# EAGLE board Sensor_POD (EAGLE 9.0.1)
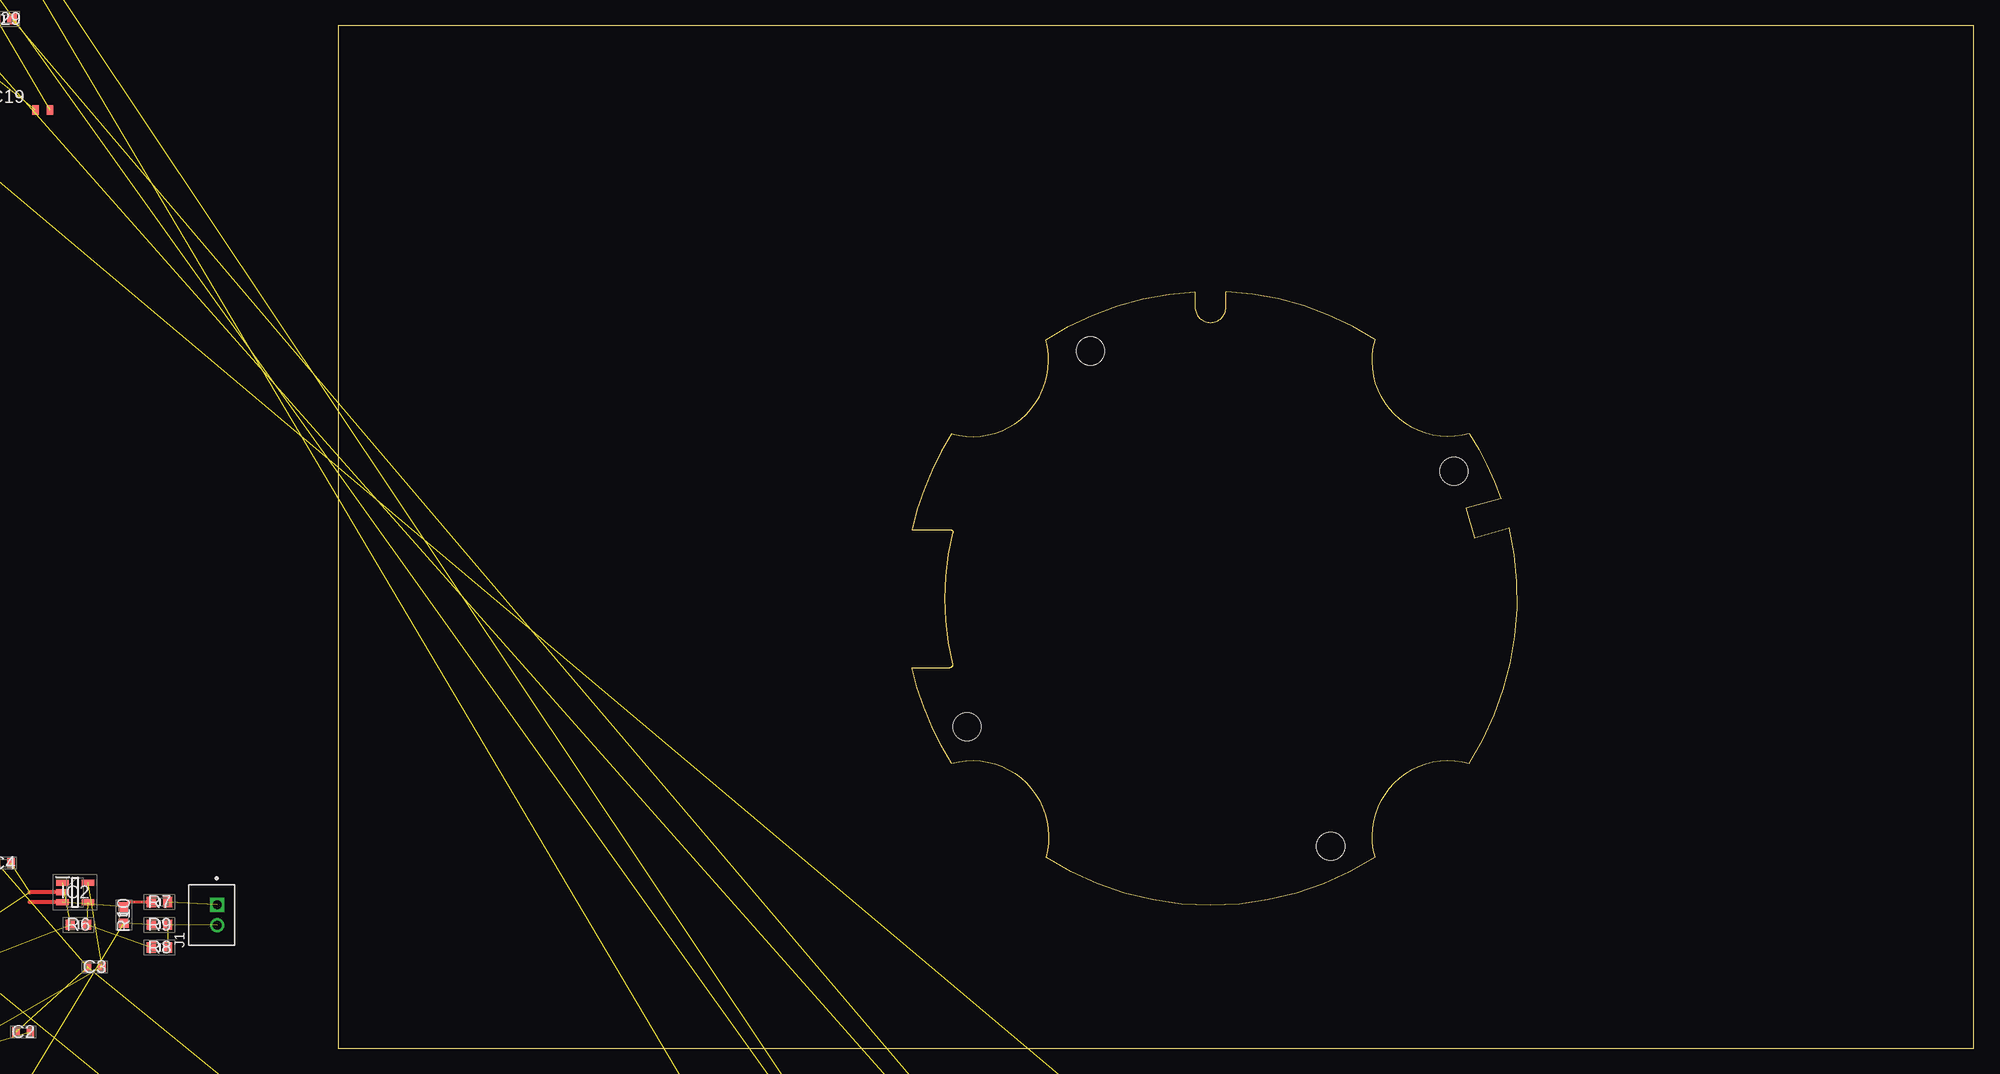
[diagram p9: board, top side]

Size 160 x 100 mm. Coordinates in mm from the lower left corner, seen from the top.
Outline: 83.82,73.9 83.82,72.47 arc180 86.84,72.47 86.84,73.9
Outline: 86.84,73.98 arc-30 101.44,69.29 arc122 110.65,60.09 arc-14 113.74,53.74 110.33,52.78 111.12,49.93 114.54,50.88 arc-46 110.65,27.86 arc122 101.44,18.65 arc-65 69.22,18.65 arc121 60.01,27.86 arc-19 56.12,37.23 59.77,37.23 arc90 60.17,37.54 arc-28 60.17,50.4 arc90 59.85,50.72 56.12,50.72 arc-19 60.01,60.09 arc121 69.22,69.29 arc-30 83.82,73.98
Outline: 0,0 160,0 160,100 0,100 0,0
Copper layers (1*16): Top 0.035mm / dielectric 1.5mm / Bottom 0.035mm
Design rules "default": minimum track width 6mil, minimum drill 0.35mm, track to track 6mil, track to pad 6mil, pad to pad 6mil, via to via 6mil, smd to smd 6mil, copper to edge 40mil, drill to drill 6mil, minimum pad ring 10mil, minimum via ring 8mil, stop-mask expansion 4mil, vias tented up to drill 0mil, thermal gap 10mil
Holes 2.75 mm at 73.58,68.18 97.08,19.76 109.14,56.44 61.52,31.43

## Footprints (pad centres in the part's own frame; a part is rotated, then mirrored left to right if it is on the bottom)
CAPC1608X90N = smd 0.75 x 0.94: 1 -0.7,0; 2 0.7,0
CAPC1608X100N = smd 0.87 x 1.02: 1 -0.68,0; 2 0.68,0
CAPC1608X85N = smd 0.66 x 0.94: 1 -0.711,0; 2 0.711,0
CAPC1608X87N = smd 0.78 x 0.98: 1 -0.7,0; 2 0.7,0
CAPC1608X90N@1 = smd 0.75 x 0.94: 1 -0.7,0; 2 0.7,0
CAPC1608X97N = smd 0.78 x 0.98: 1 -0.7,0; 2 0.7,0
FDLL914B = smd 1.25 x 2: 1 -1.875,0; 2 1.875,0
BLM18KG102SH1J = smd 0.65 x 0.7: 1 -0.675,0; 2 0.675,0
BEADC1608X75N = smd 0.9 x 1: 1 -0.8,0; 2 0.8,0
SOT95P280X145-5N = smd 1.25 x 0.6: 1 -1.25,0.95; 2 -1.25,0; 3 -1.25,-0.95; 4 1.25,-0.95; 5 1.25,0.95
SOP65P490X110-9N = smd 1.425 x 0.45: 1 -2.212,0.975; 2 -2.212,0.325; 3 -2.212,-0.325; 4 -2.212,-0.975; 5 2.212,-0.975; 6 2.212,-0.325; 7 2.212,0.325; 8 2.212,0.975 | smd 1.88 x 2.515: 9 0,0
SOP50P490X110-10N = smd 1.4 x 0.3: 1 -2.2,1; 2 -2.2,0.5; 3 -2.2,0; 4 -2.2,-0.5; 5 -2.2,-1; 6 2.2,-1; 7 2.2,-0.5; 8 2.2,0; 9 2.2,0.5; 10 2.2,1
SOP65P640X120-24N = smd 1.475 x 0.45: 1 -2.938,3.575; 2 -2.938,2.925; 3 -2.938,2.275; 4 -2.938,1.625; 5 -2.938,0.975; 6 -2.938,0.325; 7 -2.938,-0.325; 8 -2.938,-0.975; 9 -2.938,-1.625; 10 -2.938,-2.275; 11 -2.938,-2.925; 12 -2.938,-3.575; 13 2.938,-3.575; 14 2.938,-2.925; 15 2.938,-2.275; 16 2.938,-1.625; 17 2.938,-0.975; 18 2.938,-0.325; 19 2.938,0.325; 20 2.938,0.975; 21 2.938,1.625; 22 2.938,2.275; 23 2.938,2.925; 24 2.938,3.575
SOT95P280X110-5N = smd 1.25 x 0.6: 1 -1.25,0.95; 2 -1.25,0; 3 -1.25,-0.95; 4 1.25,-0.95; 5 1.25,0.95
SOP65P490X110-8N = smd 1.425 x 0.45: 1 -2.212,0.975; 2 -2.212,0.325; 3 -2.212,-0.325; 4 -2.212,-0.975; 5 2.212,-0.975; 6 2.212,-0.325; 7 2.212,0.325; 8 2.212,0.975
SOT65P210X110-5N = smd 1.2 x 0.4: 1 -0.95,0.65; 2 -0.95,0; 3 -0.95,-0.65; 4 0.95,-0.65; 5 0.95,0.65
SO08 = smd 0.6 x 2.2: 1 -1.905,-2.6; 2 -0.635,-2.6; 3 0.635,-2.6; 4 1.905,-2.6; 5 1.905,2.6; 6 0.635,2.6; 7 -0.635,2.6; 8 -1.905,2.6
SOT95P280X110-6N = smd 1.25 x 0.6: 1 -1.25,0.95; 2 -1.25,0; 3 -1.25,-0.95; 4 1.25,-0.95; 5 1.25,0; 6 1.25,0.95
SOIC127P600X175-8N = smd 1.528 x 0.65: 1 -2.711,1.905; 2 -2.711,0.635; 3 -2.711,-0.635; 4 -2.711,-1.905; 5 2.711,-1.905; 6 2.711,-0.635; 7 2.711,0.635; 8 2.711,1.905
SOT95P280X145-6N = smd 1.2 x 0.6: 1 -1.25,0.95; 2 -1.25,0; 3 -1.25,-0.95; 4 1.25,-0.95; 5 1.25,0; 6 1.25,0.95
QFP50P900X900X160-48N = smd 1.475 x 0.3: 1 -4.238,2.75; 2 -4.238,2.25; 3 -4.238,1.75; 4 -4.238,1.25; 5 -4.238,0.75; 6 -4.238,0.25; 7 -4.238,-0.25; 8 -4.238,-0.75; 9 -4.238,-1.25; 10 -4.238,-1.75; 11 -4.238,-2.25; 12 -4.238,-2.75; 25 4.238,-2.75; 26 4.238,-2.25; 27 4.238,-1.75; 28 4.238,-1.25; 29 4.238,-0.75; 30 4.238,-0.25; 31 4.238,0.25; 32 4.238,0.75; 33 4.238,1.25; 34 4.238,1.75; 35 4.238,2.25; 36 4.238,2.75 | smd 0.3 x 1.475: 13 -2.75,-4.238; 14 -2.25,-4.238; 15 -1.75,-4.238; 16 -1.25,-4.238; 17 -0.75,-4.238; 18 -0.25,-4.238; 19 0.25,-4.238; 20 0.75,-4.238; 21 1.25,-4.238; 22 1.75,-4.238; 23 2.25,-4.238; 24 2.75,-4.238; 37 2.75,4.238; 38 2.25,4.238; 39 1.75,4.238; 40 1.25,4.238; 41 0.75,4.238; 42 0.25,4.238; 43 -0.25,4.238; 44 -0.75,4.238; 45 -1.25,4.238; 46 -1.75,4.238; 47 -2.25,4.238; 48 -2.75,4.238
JST_B2B-PH-K-S(LF)(SN) = drill 0.86 square: 1 1,-0.55 | drill 0.86: 2 -1,-0.55
SHDR4W50P0X200_1X4_990X450X600 = drill 0.9 pad 1.35 square: 1 0,0 | drill 0.9 pad 1.35: 2 -2,0; 3 -4,0; 4 -6,0
SHDR5W50P0X200_1X5_1190X450X60 = drill 0.9 pad 1.35 square: 1 0,0 | drill 0.9 pad 1.35: 2 -2,0; 3 -4,0; 4 -6,0; 5 -8,0
RESC1608X55N@2 = smd 0.9 x 1: 1 -0.8,0; 2 0.8,0
RESC1608X50N = smd 0.95 x 1: 1 -0.8,0; 2 0.8,0
RESC1608X55N = smd 0.9 x 1: 1 -0.8,0; 2 0.8,0
R0603 = smd 1 x 1.1: 1 -0.85,0; 2 0.85,0
RESC1608X55N@1 = smd 0.9 x 1: 1 -0.8,0; 2 0.8,0
SOT23 = smd 1 x 1.4: 1 -0.95,-1.1; 2 0.95,-1.1; 3 0,1.1
B1,27 = smd 1.27 x 1.27: TP 0,0
FA20H160000MF12ZAC3 = smd 1.2 x 1.1: 1 -0.85,-0.7; 2 0.85,-0.7; 3 0.85,0.7; 4 -0.85,0.7

## Placement (x,y rotation side)
C1  0603YC105JAT2A  [CAPC1608X90N]  -131.76,-64.45 0 top  (outside the outline)
C2  0603YC105JAT2A  [CAPC1608X90N]  -30.8,1.59 0 top  (outside the outline)
C3  100nF / 16V  [CAPC1608X90N]  -23.81,7.94 0 top  (outside the outline)
C4  100nF / 16V  [CAPC1608X90N]  -32.7,18.1 0 top  (outside the outline)
C5  100nF / 16V  [CAPC1608X90N]  -147,-68.26 0 top  (outside the outline)
C6  100nF / 16V  [CAPC1608X90N]  -143.19,-68.26 0 top  (outside the outline)
C7  100nf / 16V  [CAPC1608X90N]  -317.18,-489.9 0 top  (outside the outline)
C8  100nF / 16V  [CAPC1608X90N]  -150.81,-75.88 0 top  (outside the outline)
C9  100nF / 16V  [CAPC1608X90N]  -150.81,-79.69 0 top  (outside the outline)
C10  3.3uF/ 35V  [CAPC1608X90N]  -154.62,-87.31 0 top  (outside the outline)
C11  10uF / 16V  [CAPC1608X100N]  -214.31,-201.61 0 top  (outside the outline)
C12  10uF / 16V  [CAPC1608X100N]  -214.31,-205.42 0 top  (outside the outline)
C13  0603YC104JAT2A  [CAPC1608X90N]  113.03,-41.91 0 top  (outside the outline)
C14  0603YC104JAT2A  [CAPC1608X90N]  109.22,-45.72 0 top  (outside the outline)
C15  0603YC104JAT2A  [CAPC1608X90N]  99.06,-64.77 0 top  (outside the outline)
C16  0603YC104JAT2A  [CAPC1608X90N]  95.25,-68.58 0 top  (outside the outline)
C17  0603YC104JAT2A  [CAPC1608X90N]  87.63,-76.2 0 top  (outside the outline)
C18  0603YC104JAT2A  [CAPC1608X90N]  83.82,-80.01 0 top  (outside the outline)
C19  C0603C102J5GACTU  [CAPC1608X85N]  -28.89,91.76 0 top  (outside the outline)
C20  C0603C103J5RACTU  [CAPC1608X87N]  -40.32,84.14 0 top  (outside the outline)
C21  100nF / 16v  [CAPC1608X90N]  -59.37,53.66 0 top  (outside the outline)
C22  100nF / 16V  [CAPC1608X90N]  -63.18,49.85 0 top  (outside the outline)
C23  0603YC104JAT2A  [CAPC1608X90N]  -63.18,38.42 0 top  (outside the outline)
C24  0603YC104JAT2A  [CAPC1608X90N]  -63.18,34.61 0 top  (outside the outline)
C25  100nf / 16V  [CAPC1608X90N]  -65.72,26.99 0 top  (outside the outline)
C26  100nF / 16V  [CAPC1608X90N]  -65.72,23.18 0 top  (outside the outline)
C27  0603YC104JAT2A  [CAPC1608X90N]  -68.26,15.56 0 top  (outside the outline)
C28  0603YC104JAT2A  [CAPC1608X90N]  -58.74,10.48 0 top  (outside the outline)
C29  10uF / 16V  [CAPC1608X100N]  -214.31,-209.23 0 top  (outside the outline)
C30  C0603C103J5RACTU  [CAPC1608X87N]  -173.67,-122.87 0 top  (outside the outline)
C31  C0603C103J5RACTU  [CAPC1608X87N]  -178.75,-126.68 0 top  (outside the outline)
C32  47nF / 25V  [CAPC1608X90N@1]  -186.37,-134.3 0 top  (outside the outline)
C33  1uF / 25V  [CAPC1608X90N@1]  -190.18,-138.11 0 top  (outside the outline)
C34  2.2uF / 10V  [CAPC1608X90N@1]  -193.99,-141.92 0 top  (outside the outline)
C35  47nF / 25V  [CAPC1608X90N@1]  -193.99,-153.35 0 top  (outside the outline)
C36  1uF / 25V  [CAPC1608X90N@1]  -193.99,-157.16 0 top  (outside the outline)
C37  2.2uF / 10V  [CAPC1608X90N@1]  -193.99,-149.54 0 top  (outside the outline)
C38  100nF / 16V  [CAPC1608X90N@1]  -202.88,-182.56 0 top  (outside the outline)
C39  10uF / 16V  [CAPC1608X100N]  -206.69,-186.37 0 top  (outside the outline)
C40  10uF / 16V  [CAPC1608X100N]  -209.23,-193.99 0 top  (outside the outline)
C41  10uF / 16V  [CAPC1608X100N]  -214.31,-197.8 0 top  (outside the outline)
C42  22nF / 25V  [CAPC1608X90N@1]  -214.31,-213.04 0 top  (outside the outline)
C43  10uF / 16V  [CAPC1608X100N]  -216.85,-220.66 0 top  (outside the outline)
C44  100nF / 16V  [CAPC1608X90N]  -216.85,-224.47 0 top  (outside the outline)
C45  100nF / 16V  [CAPC1608X90N]  -218.12,-228.28 0 top  (outside the outline)
C46  470nF / 25v  [CAPC1608X90N@1]  -219.39,-247.33 0 top  (outside the outline)
C47  470nF / 25v  [CAPC1608X90N@1]  -225.74,-251.14 0 top  (outside the outline)
C48  470nF / 25v  [CAPC1608X90N@1]  -232.09,-254.95 0 top  (outside the outline)
C49  100nF / 16V  [CAPC1608X90N]  -238.44,-280.35 0 top  (outside the outline)
C50  100nF / 16V  [CAPC1608X90N]  -245.75,-324.49 0 top  (outside the outline)
C51  1uf / 16V  [CAPC1608X90N]  -252.41,-331.47 0 top  (outside the outline)
C52  1uF / 16V  [CAPC1608X90N]  -256.22,-334.64 0 top  (outside the outline)
C53  1uF / 16V  [CAPC1608X90N]  -260.03,-337.82 0 top  (outside the outline)
C54  100nF / 16V  [CAPC1608X90N@1]  -264.8,-382.9 0 top  (outside the outline)
C55  100nF / 16V  [CAPC1608X90N@1]  -266.06,-386.08 0 top  (outside the outline)
C56  100nF / 16V  [CAPC1608X90N@1]  -267.33,-389.25 0 top  (outside the outline)
C57  100nF / 16V  [CAPC1608X90N@1]  -268.61,-392.43 0 top  (outside the outline)
C58  100nF / 16V  [CAPC1608X90N@1]  -277.5,-409.89 0 top  (outside the outline)
C59  16pF - NP0  [CAPC1608X97N]  -298.77,-418.78 0 top  (outside the outline)
C60  16pF - NP0  [CAPC1608X97N]  -303.53,-422.27 0 top  (outside the outline)
C61  100nf / 16V  [CAPC1608X90N]  -318.13,-493.08 0 top  (outside the outline)
C62  100nF / 16V  [CAPC1608X90N@1]  -323.53,-517.52 0 top  (outside the outline)
C63  100nF / 16V  [CAPC1608X90N@1]  -324.8,-520.7 0 top  (outside the outline)
D1  FDLL914B  [FDLL914B]  113.03,-36.83 0 top  (outside the outline)
FB1  1K @ 100MHz  [BLM18KG102SH1J]  -193.99,-174.94 0 top  (outside the outline)
FB2  600 @ 100MHz  [BEADC1608X75N]  -197.8,-178.75 0 top  (outside the outline)
FB3  600 @ 100MHz  [BEADC1608X75N]  -214.31,-216.85 0 top  (outside the outline)
FB4  600 @ 100MHz  [BEADC1608X75N]  -306.39,-437.51 0 top  (outside the outline)
IC1  LPV811DBVR  [SOT95P280X145-5N]  -141.92,-60.64 0 top  (outside the outline)
IC2  LPV811DBVR  [SOT95P280X145-5N]  -25.72,15.24 0 top  (outside the outline)
IC3  MAX4660EUA+T  [SOP65P490X110-9N]  -310.83,-468.31 0 top  (outside the outline)
IC5  ADS1115BQDGSRQ1  [SOP50P490X110-10N]  -163.51,-102.55 0 top  (outside the outline)
IC6  PGA280AIPW  [SOP65P640X120-24N]  -167.32,-108.9 0 top  (outside the outline)
IC7  TPS73433DDCR  [SOT95P280X110-5N]  -183.83,-130.49 0 top  (outside the outline)
IC8  OPA322AIDBVR  [SOT95P280X145-5N]  116.84,-30.48 0 top  (outside the outline)
IC9  INA333AIDGKR  [SOP65P490X110-8N]  104.14,-57.15 0 top  (outside the outline)
IC10  OPA333AIDCKTG4  [SOT65P210X110-5N]  91.44,-72.39 0 top  (outside the outline)
IC11  MAX4564EUA+  [SOP65P490X110-8N]  -63.18,30.8 0 top  (outside the outline)
IC12  OPA2187  [SO08]  -59.37,68.9 0 top  (outside the outline)
IC13  OPA187IDBVR  [SOT95P280X145-5N]  -65.72,19.37 0 top  (outside the outline)
IC14  TPS73433DDCR  [SOT95P280X110-5N]  -191.45,-145.73 0 top  (outside the outline)
IC15  REG71050DDCR  [SOT95P280X110-6N]  -206.69,-190.18 0 top  (outside the outline)
IC16  SN65HVD72D  [SOIC127P600X175-8N]  -237.17,-275.27 0 top  (outside the outline)
IC18  MAX11212AEUB+  [SOP50P490X110-10N]  -241.94,-307.02 0 top  (outside the outline)
IC19  MAX4660EUA+T  [SOP65P490X110-9N]  -313.69,-476.88 0 top  (outside the outline)
IC20  LM2664M6_NOPB  [SOT95P280X145-6N]  -326.07,-524.19 0 top  (outside the outline)
IC21  MAX4564EUA+  [SOP65P490X110-8N]  -308.61,-458.79 0 top  (outside the outline)
IC22  STM32L443CCT6  [QFP50P900X900X160-48N]  -328.3,-531.81 0 top  (outside the outline)
J1  pH  [JST_B2B-PH-K-S(LF)(SN)]  -12.38,13.02 90 top  (outside the outline)
J2  DO  [JST_B2B-PH-K-S(LF)(SN)]  -140.65,-50.48 0 top  (outside the outline)
J3  B4B-PH-K-S_LF__SN_  [SHDR4W50P0X200_1X4_990X450X600]  -173.67,-165.1 90 top  (outside the outline)
J4  Temp  [JST_B2B-PH-K-S(LF)(SN)]  -241.94,-315.28 0 top  (outside the outline)
J5  EC  [JST_B2B-PH-K-S(LF)(SN)]  83.82,-88.9 0 top  (outside the outline)
J6  B5B-PH-K-S_LF__SN_  [SHDR5W50P0X200_1X5_1190X450X60]  -249.24,-346.71 0 top  (outside the outline)
R1  20K - 0.1%  [RESC1608X55N@2]  -129.22,-60.64 0 top  (outside the outline)
R2  20K - 0.1%  [RESC1608X55N@2]  -147,-64.45 0 top  (outside the outline)
R3  20K - 0.1%  [RESC1608X55N@2]  -143.19,-64.45 0 top  (outside the outline)
R4  20K - 0.1%  [RESC1608X55N@2]  -139.38,-64.45 0 top  (outside the outline)
R5  20K - 0.1%  [RESC1608X55N@2]  -135.57,-64.45 0 top  (outside the outline)
R6  20K - 0.1%  [RESC1608X55N@2]  -25.4,12.06 0 top  (outside the outline)
R7  20K - 0.1%  [RESC1608X55N@2]  -17.46,14.29 0 top  (outside the outline)
R8  20K - 0.1%  [RESC1608X55N@2]  -17.46,9.84 0 top  (outside the outline)
R9  20K - 0.1%  [RESC1608X55N@2]  -17.46,12.06 0 top  (outside the outline)
R10  20K - 0.1%  [RESC1608X55N@2]  -20.95,13.02 90 top  (outside the outline)
R11  1K - 0.1%  [RESC1608X50N]  -135.57,-30.16 0 top  (outside the outline)
R12  [RESC1608X50N]  -133.03,-60.64 0 top  (outside the outline)
R13  100Ohm  [RESC1608X55N@2]  -168.59,-115.25 0 top  (outside the outline)
R14  100Ohm  [RESC1608X55N@2]  -171.13,-119.06 0 top  (outside the outline)
R15  10Ohm  [RESC1608X55N@2]  -219.39,-232.09 0 top  (outside the outline)
R16  22ohm  [RESC1608X55N@2]  -233.36,-258.76 0 top  (outside the outline)
R17  22ohm  [RESC1608X55N@2]  -235.9,-262.57 0 top  (outside the outline)
R18  10Ohm  [RESC1608X55N@2]  -219.39,-243.52 0 top  (outside the outline)
R19  10KOhm  [RESC1608X55N@2]  -234.63,-266.38 0 top  (outside the outline)
R20  22KOhm  [RESC1608X55N]  -238.44,-270.19 0 top  (outside the outline)
R21  120Ohm  [RESC1608X55N@2]  -239.71,-284.16 0 top  (outside the outline)
R22  20KOhm  [RESC1608X55N@2]  -239.71,-287.97 0 top  (outside the outline)
R23  47KOhm  [RESC1608X55N@2]  -239.71,-291.78 0 top  (outside the outline)
R24  10K - 0.1%  [RESC1608X55N@2]  -249.56,-327.98 0 top  (outside the outline)
R25  ERJ3RBD4701V  [RESC1608X55N]  -37.78,87.95 0 top  (outside the outline)
R26  [R0603]  96.52,-60.96 0 top  (outside the outline)
R27  RG1608P-102-B-T5  [RESC1608X50N]  -31.43,108.27 0 top  (outside the outline)
R28  RG1608P-102-B-T5  [RESC1608X50N]  -35.24,104.46 0 top  (outside the outline)
R29  ERA3AEB101V  [RESC1608X55N@2]  -32.7,100.65 0 top  (outside the outline)
R30  ERA3AEB101V  [RESC1608X55N@2]  -35.24,96.84 0 top  (outside the outline)
R31  RT0603FRE0710KL  [RESC1608X55N@2]  -45.4,72.71 0 top  (outside the outline)
R32  RG1608P-102-B-T5  [RESC1608X50N]  -49.21,68.9 0 top  (outside the outline)
R33  100KOhm  [RESC1608X55N@1]  -59.37,61.28 0 top  (outside the outline)
R34  100KOhm  [RESC1608X55N@1]  -59.37,57.47 0 top  (outside the outline)
R35  100KOhm  [RESC1608X55N@1]  -60.64,46.04 0 top  (outside the outline)
R36  10KOhm  [RESC1608X55N@2]  -65.72,42.23 0 top  (outside the outline)
R37  0 ohm  [RESC1608X55N@2]  -260.35,-355.6 0 top  (outside the outline)
R38  10 Ohm  [RESC1608X55N@2]  -260.35,-375.92 0 top  (outside the outline)
R39  10 Ohm  [RESC1608X55N@2]  -265.11,-379.41 0 top  (outside the outline)
R40  10K  [RESC1608X55N@2]  -269.88,-395.92 0 top  (outside the outline)
R41  10K ( DNP )  [RESC1608X55N@2]  -272.73,-399.42 0 top  (outside the outline)
R42  100K  [RESC1608X55N@1]  -274,-402.91 0 top  (outside the outline)
R43  100K  [RESC1608X55N@1]  -279.08,-406.4 0 top  (outside the outline)
R44  22k  [RESC1608X55N]  -311.47,-462.28 0 top  (outside the outline)
R45  22k  [RESC1608X55N]  -318.77,-482.92 0 top  (outside the outline)
R46  22k  [RESC1608X55N]  -318.77,-486.41 0 top  (outside the outline)
R47  4k7  [RESC1608X55N]  -319.09,-496.57 0 top  (outside the outline)
R48  4k7  [RESC1608X55N]  -322.26,-500.06 0 top  (outside the outline)
R49  4k7  [RESC1608X55N]  -325.44,-503.56 0 top  (outside the outline)
R50  47KOhm  [RESC1608X55N@2]  -323.53,-507.05 0 top  (outside the outline)
R51  100K  [RESC1608X55N@1]  -324.8,-510.54 0 top  (outside the outline)
R52  100K  [RESC1608X55N@1]  -324.8,-514.03 0 top  (outside the outline)
T1  BC847  [SOT23]  -46.67,77.79 0 top  (outside the outline)
TP1  TPB1,27  [B1,27]  -262.25,-360.36 0 top  (outside the outline)
TP2  TPB1,27  [B1,27]  -262.25,-364.49 0 top  (outside the outline)
TP3  TPB1,27  [B1,27]  -262.25,-368.62 0 top  (outside the outline)
TP4  TPB1,27  [B1,27]  -262.25,-372.75 0 top  (outside the outline)
Y1  FA-20H_24.0000MF15Y-W3  [FA20H160000MF12ZAC3]  -290.83,-414.02 0 top  (outside the outline)

## Tracks (layer width: path | path; a pad name or v marks a point on that pad's centre or on a via)
ADC_RDY  (2 unrouted)
ADC_SCL  (2 unrouted)
ADC_SDA  (2 unrouted)
AGND  (55 unrouted)
AIN0  (3 unrouted)
AIN1  (3 unrouted)
AVCC  (9 unrouted)
CELL_ADC1  (2 unrouted)
CELL_ADC2  (2 unrouted)
DVCC  (24 unrouted)
EC+  (12 unrouted)
EC-  (12 unrouted)
EC_ADC  (3 unrouted)
EC_DAC  (1 unrouted)
EC_EXCITATION  (1 unrouted)
EC_EXT_ADC  (2 unrouted)
EC_PULSE  (1 unrouted)
EC_PULSE_EN  (2 unrouted)
EC_REF(+)  (4 unrouted)
EC_REF(-)  (4 unrouted)
EC_RST  (2 unrouted)
EN_GND  (3 unrouted)
GND  (42 unrouted)
GND_DO  (2 unrouted)
GND_PH  (2 unrouted)
GND_SW  (2 unrouted)
N$1  (2 unrouted)
N$2  (2 unrouted)
N$3  (1 unrouted)
N$4  (2 unrouted)
N$5  (2 unrouted)
N$6  (1 unrouted)
N$7  (1 unrouted)
N$8  (1 unrouted)
N$9  (1 unrouted)
N$10  (2 unrouted)
N$11  (2 unrouted)
N$12  (1 unrouted)
  Top 0.305: R7.1 -20.48,14.29 R10.2
  Top 0.406: IC2.3 -30.16,14.29
N$13  (2 unrouted)
N$14  (1 unrouted)
N$15  (1 unrouted)
N$18  (2 unrouted)
N$19  (2 unrouted)
N$20  (1 unrouted)
N$21  (2 unrouted)
N$22  (1 unrouted)
N$23  (2 unrouted)
N$24  (1 unrouted)
N$25  (1 unrouted)
N$26  (2 unrouted)
N$27  (1 unrouted)
N$28  (3 unrouted)
N$29  (3 unrouted)
N$30  (2 unrouted)
N$31  (2 unrouted)
N$32  (2 unrouted)
N$33  (2 unrouted)
N$34  (2 unrouted)
N$35  (1 unrouted)
N$36  (1 unrouted)
N$37  (1 unrouted)
N$38  (1 unrouted)
N$39  (1 unrouted)
N$40  (2 unrouted)
N$41  (1 unrouted)
N$42  (1 unrouted)
N$43  (2 unrouted)
N$44  (4 unrouted)
N$45  (3 unrouted)
N$46  (1 unrouted)
N$47  (1 unrouted)
N$48  (2 unrouted)
N$49  (2 unrouted)
N$50  (1 unrouted)
N$52  (2 unrouted)
NRST  (2 unrouted)
RS485-A  (2 unrouted)
RS485-B  (2 unrouted)
SEN_PWR_EN  (1 unrouted)
SEN_PWR_SW  (2 unrouted)
SPI1_MISO  (1 unrouted)
SPI1_SCK  (1 unrouted)
SPI3_CS  (1 unrouted)
SPI3_MISO  (1 unrouted)
SPI3_MOSI  (1 unrouted)
SPI3_SCK  (1 unrouted)
SWCLK  (1 unrouted)
SWDIO  (1 unrouted)
UART_DE  (2 unrouted)
UART_RX  (1 unrouted)
UART_RX_EN  (2 unrouted)
UART_TX  (1 unrouted)
USB_DM  (1 unrouted)
USB_DP  (1 unrouted)
V-IN  (10 unrouted)
V-PRE-AMP(+)  (6 unrouted)
V-PRE-AMP(-)  (6 unrouted)
  Top 0.406: IC2.2 -30.16,15.24
V-SEN(+)  (11 unrouted)
V-SEN(-)  (6 unrouted)